# EAGLE design Level-Shifter-4_v11 (EAGLE 7.7.0)
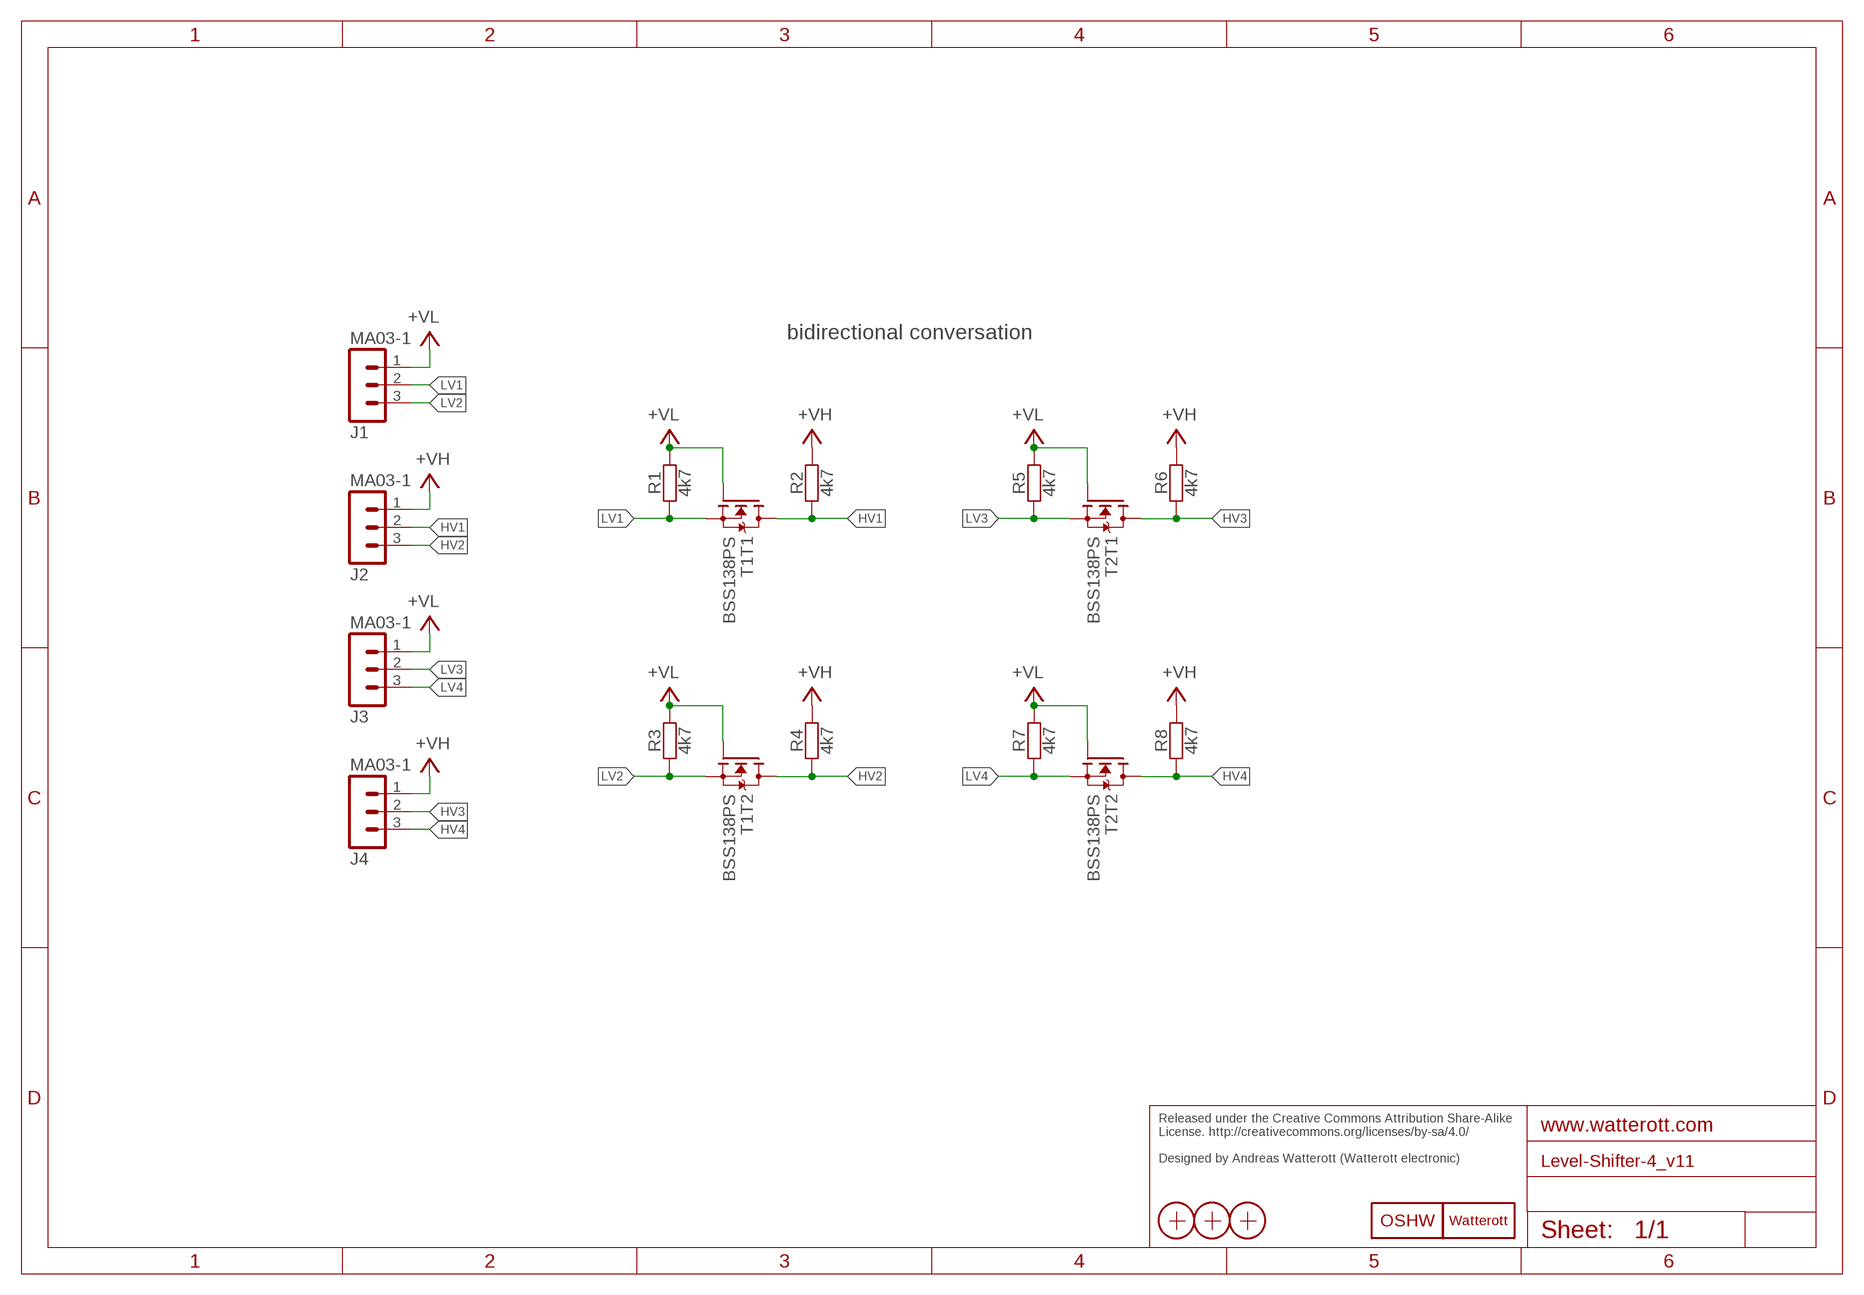
[diagram p0: schematic, sheet 1]

## Parts
J1  MA03-1  [MA03-1]
J2  MA03-1  [MA03-1]
J3  MA03-1  [MA03-1]
J4  MA03-1  [MA03-1]
LOGO1  OSHW_LOGOX0070  [OSHW_6X70]
LOGO2  LOGO-S_PLACE_S  [SPARK_TPLACE_S]
R1  4k7  RESISTOR-0402  [C0402]
R2  4k7  RESISTOR-0402  [C0402]
R3  4k7  RESISTOR-0402  [C0402]
R4  4k7  RESISTOR-0402  [C0402]
R5  4k7  RESISTOR-0402  [C0402]
R6  4k7  RESISTOR-0402  [C0402]
R7  4k7  RESISTOR-0402  [C0402]
R8  4k7  RESISTOR-0402  [C0402]
T1  BSS138PS  [SOT363]
T2  BSS138PS  [SOT363]
X1  PASSER-07  [PASSER_07MM]
X2  PASSER-07  [PASSER_07MM]
X3  PASSER-07  [PASSER_07MM]

## Nets
+VH: J2.1 J4.1 R2.2 R4.2 R6.2 R8.2
+VL: J1.1 J3.1 R1.2 R3.2 R5.2 R7.2 T1.2(T1:G) T1.5(T2:G) T2.2(T1:G) T2.5(T2:G)
HV1: J2.2 R2.1 T1.6(T1:D)
HV2: J2.3 R4.1 T1.3(T2:D)
HV3: J4.2 R6.1 T2.6(T1:D)
HV4: J4.3 R8.1 T2.3(T2:D)
LV1: J1.2 R1.1 T1.1(T1:S)
LV2: J1.3 R3.1 T1.4(T2:S)
LV3: J3.2 R5.1 T2.1(T1:S)
LV4: J3.3 R7.1 T2.4(T2:S)

## Notes on the sheet
- bidirectional conversation
- Released under the Creative Commons Attribution Share-Alike 
  License. http://creativecommons.org/licenses/by-sa/4.0/
  
  Designed by Andreas Watterott (Watterott electronic)

## Library data of the parts
J1-J4 = we-con:MA03-1: Pin Header
LOGO1 = we-symbol:OSHW_LOGO: Open-Source-Hardware Logo
LOGO2 = we-symbol:LOGO: Watterott electronic Logo
R1-R8 = we-rcl:RESISTOR: Resistors all kinds in 0402 and 0603
T1 T2 = we-transistor:BSS138PS: Dual N-Channel MOSFET BSS138 (Vgs>=+/-20V, Vds>=40V, Id>=0.2A + Rds<=3Ohm @ Vgs=4.5V)
X1-X3 = we-symbol:PASSER: Fiducial Markers

## Board
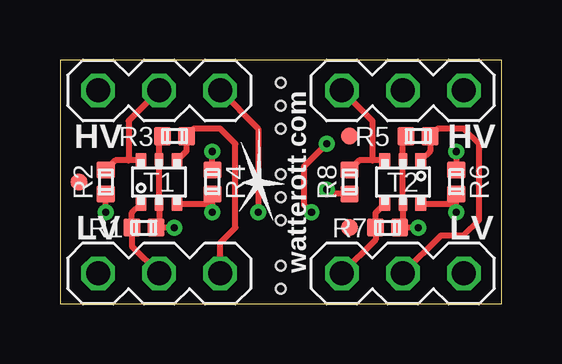
[diagram p1: board, top side]
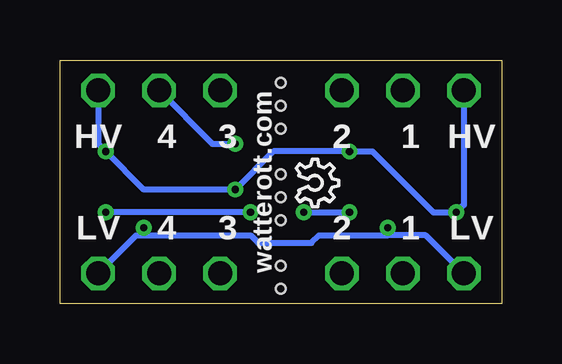
[diagram p2: board, bottom side, seen from below]

Size 18.41 x 10.16 mm. Coordinates in mm from the lower left corner, seen from the top.
Outline: 0,0 18.41,0 18.41,10.16 0,10.16 0,0
Copper layers (1*16): Top 0.035mm / dielectric 1.5mm / Bottom 0.035mm
Design rules "we-dru-2-layer *": minimum track width 0.15mm, minimum drill 0.3mm, track to track 0.15mm, track to pad 0.15mm, pad to pad 0.15mm, via to via 0.15mm, smd to smd 0.1mm, copper to edge 0.4mm, drill to drill 0.2mm, minimum pad ring 0.18mm, minimum via ring 0.18mm, stop-mask expansion 0.1mm, vias tented up to drill 0.5mm, thermal gap 0.25mm
Holes 0.4 mm at 9.21,1.59 9.21,3.49 9.21,4.45 9.21,5.4 9.21,7.3 9.21,0.64 9.21,8.26 9.21,9.21

### Footprints (pad centres in the part's own frame; a part is rotated, then mirrored left to right if it is on the bottom)
MA03-1 = drill 1 octagon: 1 0,2.54; 2 0,0; 3 0,-2.54
C0402 = smd 0.75 x 0.7: 1 0,0.5; 2 0,-0.5
SOT363 = smd 0.6 x 0.5: 1 -0.9,0.75; 3 -0.9,-0.75; 4 0.9,-0.75; 6 0.9,0.75 | smd 0.6 x 0.4: 2 -0.9,0; 5 0.9,0
PASSER_07MM = smd 0.7 x 0.7: X 0,0

### Placement (x,y rotation side)
J1  4.13,1.27 90 top
J2  4.13,8.89 90 top
J3  14.29,1.27 270 top
J4  14.29,8.89 270 top
LOGO1  8.57,6.03 270 bottom
LOGO2  8.26,5.08 90 top
R1  3.49,3.17 90 top
R2  1.91,5.08 0 top
R3  4.76,6.99 270 top
R4  6.35,5.08 180 top
R5  14.92,6.99 270 top
R6  16.51,5.08 180 top
R7  13.65,3.17 90 top
R8  12.06,5.08 0 top
T1  4.13,5.08 90 top
T2  14.29,5.08 270 top
X1  0.79,5.08 0 top
X2  12.06,6.99 0 top
X3  12.06,3.17 0 top

### Tracks (layer width: path | path; a pad name or v marks a point on that pad's centre or on a via)
+VH  (via drill 0.3)
  Top 0.254: R4.2 v6.35,6.35 | v1.91,3.81 R2.2 | R8.2 11.29,4.58 v11.11,4.76 | v16.51,6.35 R6.2
  Bottom 0.254: J2.1 1.59,4.13 v1.91,3.81 2.86,3.81 5.4,6.35 v6.35,6.35 9.53,6.35 v11.11,4.76 14.92,4.76 v16.51,6.35 16.83,6.67 J4.1
+VL  (via drill 0.3)
  Top 0.254: R3.2 4.13,6.85 T1.5 T1.2 4.13,3.31 R1.2 v4.76,3.17 | R5.2 14.29,6.85 T2.2 T2.5 14.29,3.31 | 14.29,3.31 R7.2 | v14.92,3.17 14.42,3.17 14.29,3.31
  Bottom 0.254: v14.92,3.17 14.92,2.86 | 14.92,2.86 10.48,2.86 10.16,2.54 7.94,2.54 7.62,2.86 4.76,2.86 | 4.76,2.86 v4.76,3.17 | J1.1 3.17,2.86 4.76,2.86 | J3.1 15.24,2.86 14.92,2.86
HV1
  Top 0.254: T1.6 2.86,5.98 | 2.86,5.98 2.31,5.98 R2.1 | J2.2 2.86,7.62 2.86,5.98
HV2  (via drill 0.3)
  Top 0.254: T1.3 6.3,4.18 6.35,4.13 | J2.3 8.26,7.3 v8.26,3.81 | v6.35,3.81 6.35,4.13 | 6.35,4.13 R4.1
  Bottom 0.254: v8.26,3.81 v6.35,3.81
HV3  (via drill 0.3)
  Top 0.254: v11.11,6.67 10.16,5.71 10.16,4.13 v10.48,3.81 | v16.51,3.81 16.51,4.13 | 16.51,4.13 R6.1 | T2.6 16.46,4.18 16.51,4.13
  Bottom 0.254: J4.2 12.06,6.67 v11.11,6.67 | v10.48,3.81 v16.51,3.81
HV4
  Top 0.254: T2.3 13.02,5.98 | 13.02,5.98 12.46,5.98 R8.1 | J4.3 13.02,7.62 13.02,5.98
LV1
  Top 0.254: T1.1 2.99,3.79 R1.1 2.99,2.4 J1.2
LV2
  Top 0.254: T1.4 5.26,6.37 R3.1 5.58,7.3 6.67,7.3 7.3,6.67 7.3,3.17 6.67,2.54 J1.3
LV3
  Top 0.254: T2.1 15.42,6.37 R5.1 15.74,7.3 16.83,7.3 17.46,6.67 17.46,3.49 16.83,2.86 15.88,2.86 J3.2
LV4
  Top 0.254: T2.4 13.15,3.79 R7.1 13.15,2.67 J3.3

### Text on the board
tPlace: HV | HV | watterott.com | LV | LV
bPlace: HV | 1 | 2 | 3 | 4 | HV | watterott.com | LV | 1 | 2 | 3 | 4 | LV
Reference: Silkscreen: 21 tPlace + 22 bPlace